# EAGLE schematic board (EAGLE 7.4.0)
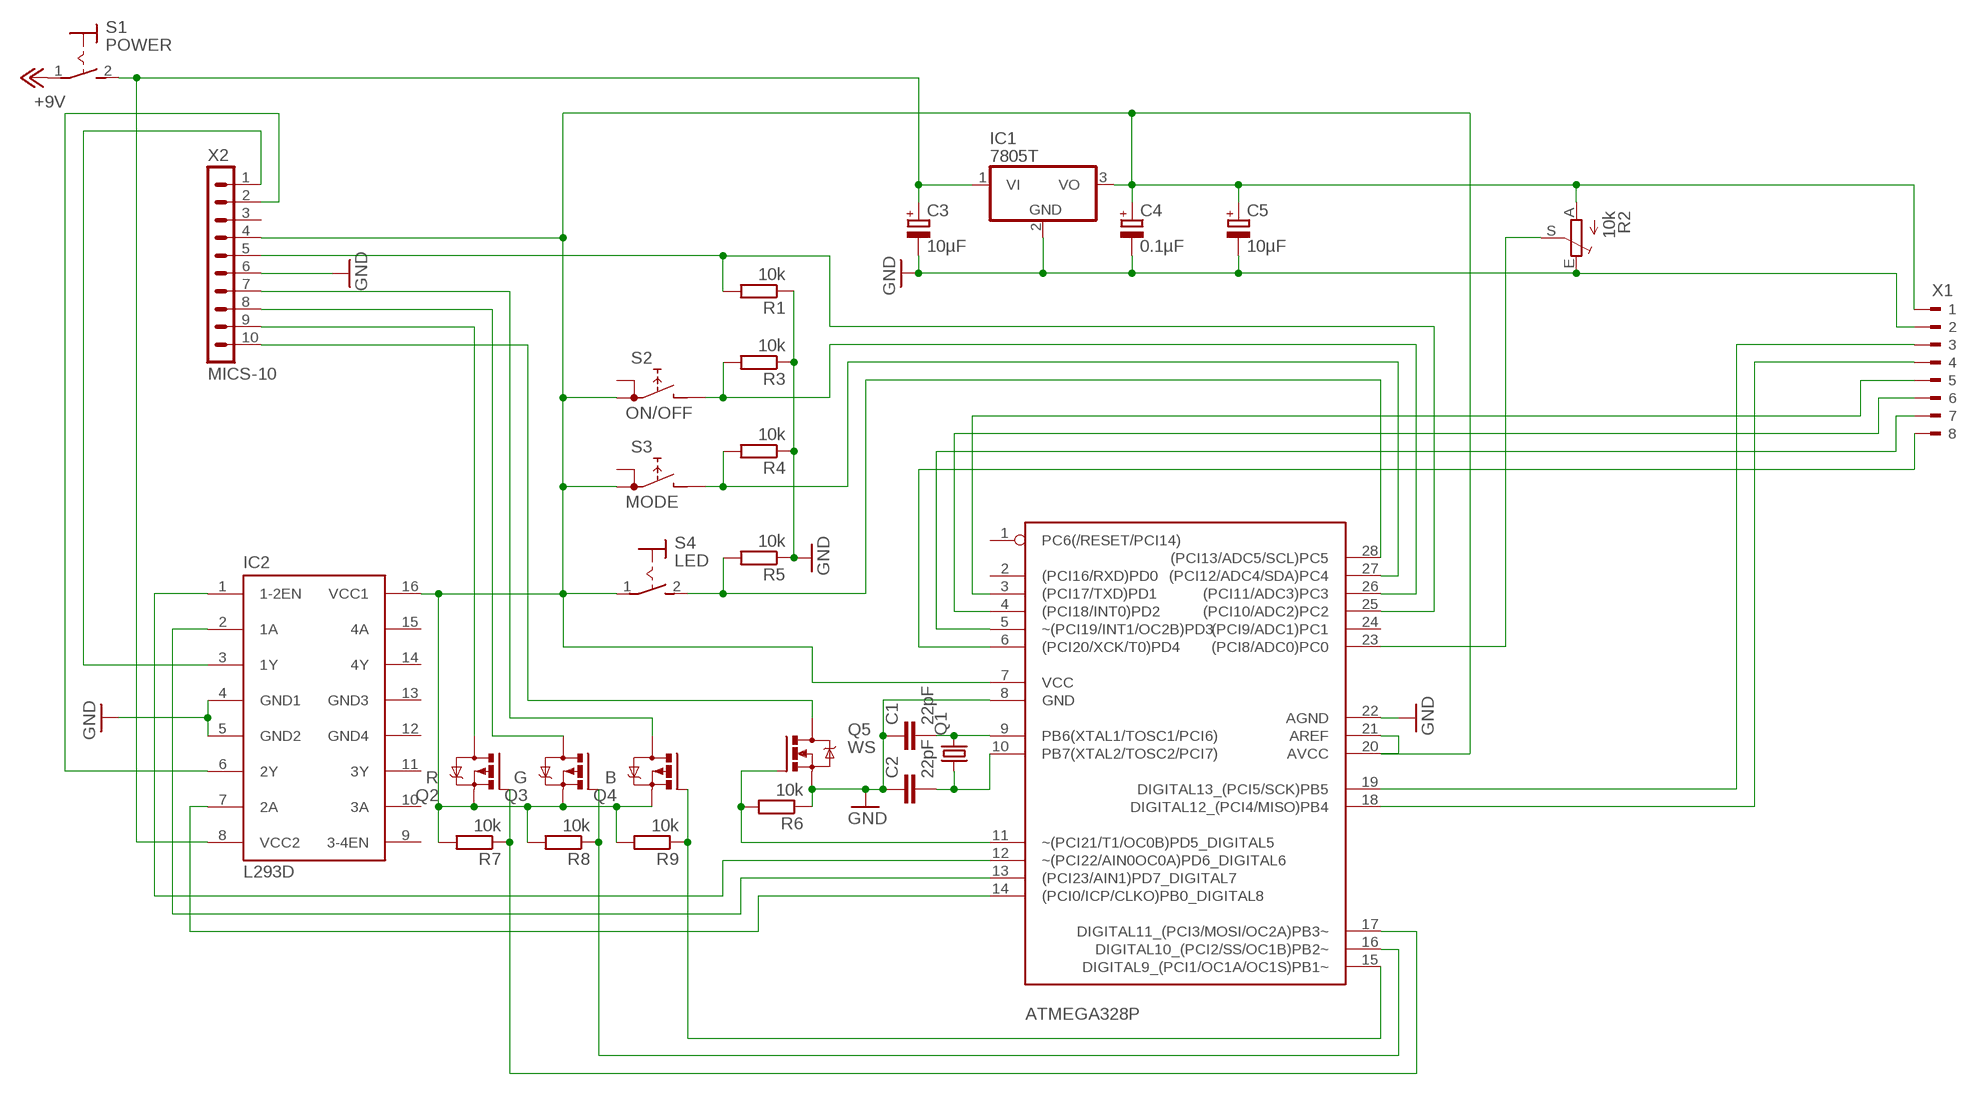
[diagram p0: schematic, sheet 1]

## Parts
ATMEGA328P  ATMEGA328-20P  [DIL28-3]
C1  22pF  C2.5/2  [C2.5-2]
C2  22pF  C2.5/2  [C2.5-2]
C3  10µF  CPOL-EUE2.5-5  [E2,5-5]
C4  0.1µF  CPOL-EUE2.5-5  [E2,5-5]
C5  10µF  CPOL-EUE2.5-5  [E2,5-5]
IC1  7805T  [TO220H]
IC2  L293D  [DIL16]
Q1  CRYSTALHC49S  [HC49/S]
Q2  R  IRFU5305  [I-PAK_TO251AA]
Q3  G  IRFU5305  [I-PAK_TO251AA]
Q4  B  IRFU5305  [I-PAK_TO251AA]
Q5  WS  IRFZ48Z  [TO220BH]
R1  10k  R-EU_0204/5  [0204/5]
R2  10k  TRIM_EU-ECP10S  [ECP10S]
R3  10k  R-EU_0204/5  [0204/5]
R4  10k  R-EU_0204/5  [0204/5]
R5  10k  R-EU_0204/5  [0204/5]
R6  10k  R-EU_0204/5  [0204/5]
R7  10k  R-EU_0204/5  [0204/5]
R8  10k  R-EU_0204/5  [0204/5]
R9  10k  R-EU_0204/5  [0204/5]
S1  POWER  MS243  [MS243]
S2  ON/OFF  RDT1034  [RDT1034]
S3  MODE  RDT1034  [RDT1034]
S4  LED  MS243  [MS243]
X1  90F-8  [90F-8]
X2  MICS-10  [MICS-10]

## Nets
+12V: S1.1(P) ; supply symbol labelled +9V
GND: ATMEGA328P.8(GND) ATMEGA328P.22(AGND) C1.1 C2.1 C3.- C4.- C5.- IC1.2(GND) IC2.4(GND1) IC2.5(GND2) Q5.S R1.1 R2.E R3.1 R4.1 R5.1 R6.1 X1.2 X2.6
N$1: ATMEGA328P.14((PCI0/ICP/CLKO)PB0_DIGITAL8) IC2.7(2A)
N$2: IC2.6(2Y) X2.2
N$3: ATMEGA328P.9(PB6(XTAL1/TOSC1/PCI6)) C1.2 Q1.2
N$4: ATMEGA328P.10(PB7(XTAL2/TOSC2/PCI7)) C2.2 Q1.1
N$5: ATMEGA328P.12(~(PCI22/AIN0OC0A)PD6_DIGITAL6) IC2.1(1-2EN)
N$6: ATMEGA328P.13((PCI23/AIN1)PD7_DIGITAL7) IC2.2(1A)
N$7: ATMEGA328P.23((PCI8/ADC0)PC0) R2.S
N$8: C3.+ IC1.1(VI) IC2.8(VCC2) S1.2(S)
N$9: IC2.3(1Y) X2.1
N$10: ATMEGA328P.26((PCI11/ADC3)PC3) R3.2 S2.B
N$11: ATMEGA328P.5(~(PCI19/INT1/OC2B)PD3) X1.7
N$12: Q2.2(D) X2.9
N$13: ATMEGA328P.11(~(PCI21/T1/OC0B)PD5_DIGITAL5) Q5.G R6.2
N$14: ATMEGA328P.6((PCI20/XCK/T0)PD4) X1.8
N$15: ATMEGA328P.4((PCI18/INT0)PD2) X1.6
N$16: ATMEGA328P.3((PCI17/TXD)PD1) X1.5
N$17: ATMEGA328P.18(DIGITAL12_(PCI4/MISO)PB4) X1.4
N$18: ATMEGA328P.19(DIGITAL13_(PCI5/SCK)PB5) X1.3
N$19: ATMEGA328P.27((PCI12/ADC4/SDA)PC4) R4.2 S3.B
N$20: ATMEGA328P.7(VCC) ATMEGA328P.20(AVCC) ATMEGA328P.21(AREF) C4.+ C5.+ IC1.3(VO) IC2.16(VCC1) Q2.3(S) Q3.3(S) Q4.3(S) R2.A R7.2 R8.2 R9.2 S2.A1 S3.A1 S4.1(P) X1.1 X2.4
N$21: ATMEGA328P.28((PCI13/ADC5/SCL)PC5) R5.2 S4.2(S)
N$22: ATMEGA328P.15(DIGITAL9_(PCI1/OC1A/OC1S)PB1~) Q4.1(G) R9.1
N$23: ATMEGA328P.16(DIGITAL10_(PCI2/SS/OC1B)PB2~) Q3.1(G) R8.1
N$24: ATMEGA328P.17(DIGITAL11_(PCI3/MOSI/OC2A)PB3~) Q2.1(G) R7.1
N$25: Q3.2(D) X2.8
N$26: Q4.2(D) X2.7
N$27: Q5.D X2.10
N$30: ATMEGA328P.25((PCI10/ADC2)PC2) R1.2 X2.5
Unconnected: ATMEGA328P.1(PC6(/RESET/PCI14)) ATMEGA328P.2((PCI16/RXD)PD0) ATMEGA328P.24((PCI9/ADC1)PC1) IC2.9(3-4EN) IC2.10(3A) IC2.11(3Y) IC2.14(4Y) IC2.15(4A) S2.A S3.A X2.3

## Power pins joined to a net without a drawn wire
GND3: IC2.13(GND3)
GND4: IC2.12(GND4)

## Library data of the parts
ATMEGA328P = atmega328:ATMEGA328*P: MICROCONTROLLER 32 kBytes FLASH 2 kBytes SRAM 1 kBytes EEPROM USART 8-channel 10 bit ADC
C1 C2 = capacitor-wima:C: CAPACITOR naming: grid - package width
C3-C5 = resistor:CPOL-EU: POLARIZED CAPACITOR, European symbol
IC1 = linear:78*: Positive VOLTAGE REGULATOR Source: http://cache.national.com/ds/LM/LM78L05.pdf http://www.fairchildsemi.com/ds/LM/LM7805.pdf
IC2 = st-microelectronics:L293D: PUSH-PULL 4 CHANNEL DRIVER; MPN: L293D; OC_FARNELL: 9589619; OC_NEWARK: 56P8249
Q1 = crystal:CRYSTAL: CRYSTAL; OC_FARNELL: 1667008; OC_NEWARK: unknown
Q2-Q4 = transistor-power:IRF?5305: HEXFET Power MOSFET Source: http://www.irf.com/product-info/datasheets/data/irfr5305pbf.pdf
Q5 = transistor-power:IRFZ48: N Channel HEXFET® Power MOSFET Logic Level Source: http://www.irf.com/product-info/datasheets/data/irfz48z.pdf
R1 R3-R9 = resistor:R-EU_: RESISTOR, European symbol
R2 = pot:TRIM_EU-: POTENTIOMETER
S1 S4 = switch:MS243: TOGGLE SWITCH
S2 S3 = switch:RDT1034: PUSH SWITCH www.radiohm.com
X1 = con-weidmueller-sl35:90F-8: WEIDMUELLER CLAMP CONNECTOR; OC_FARNELL: unknown; OC_NEWARK: unknown
X2 = con-lumberg:MICS-10: CONNECTOR; OC_FARNELL: unknown; OC_NEWARK: unknown